# EAGLE design balloon-v02 (EAGLE 7.6.0)
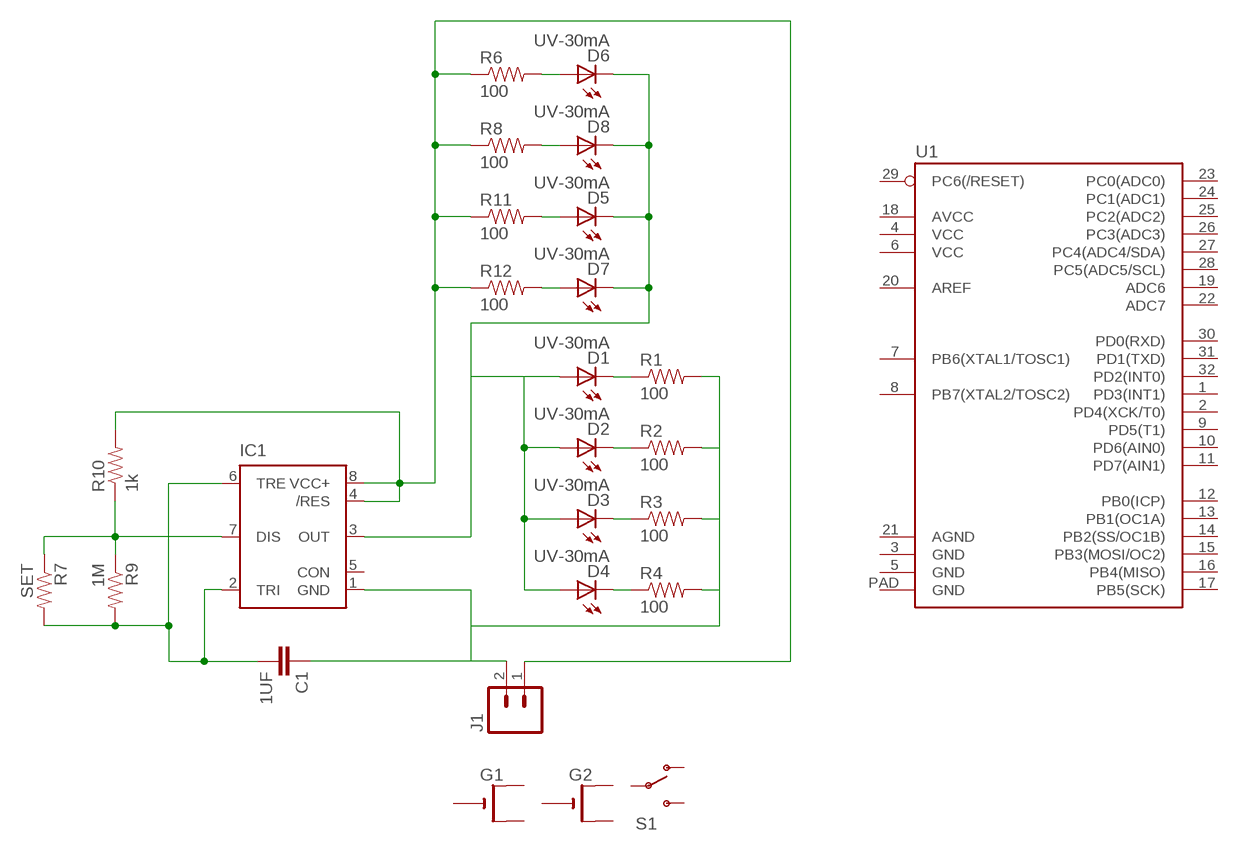
[diagram p0: schematic, sheet 1]

## Parts
C1  1UF  CAP0603-CAP  [0603-CAP]
D1  UV-30mA  LEDCHIPLED_0603  [CHIPLED_0603]
D2  UV-30mA  LEDCHIPLED_0603  [CHIPLED_0603]
D3  UV-30mA  LEDCHIPLED_0603  [CHIPLED_0603]
D4  UV-30mA  LEDCHIPLED_0603  [CHIPLED_0603]
D5  UV-30mA  LEDCHIPLED_0603  [CHIPLED_0603]
D6  UV-30mA  LEDCHIPLED_0603  [CHIPLED_0603]
D7  UV-30mA  LEDCHIPLED_0603  [CHIPLED_0603]
D8  UV-30mA  LEDCHIPLED_0603  [CHIPLED_0603]
G1  CR2032SMT  [CR2032-SMD]
G2  CR2032SMT  [CR2032-SMD]
IC1  NE555D  [SO08]
J1  M02PTH3  [1X02_LONGPADS]
R1  100  RESISTOR0603-RES  [0603-RES]
R2  100  RESISTOR0603-RES  [0603-RES]
R3  100  RESISTOR0603-RES  [0603-RES]
R4  100  RESISTOR0603-RES  [0603-RES]
R6  100  RESISTOR0603-RES  [0603-RES]
R7  SET  RESISTORKIT  [AXIAL-0.3-KIT]
R8  100  RESISTOR0603-RES  [0603-RES]
R9  1M  RESISTOR0603-RES  [0603-RES]
R10  1k  RESISTOR0603-RES  [0603-RES]
R11  100  RESISTOR0603-RES  [0603-RES]
R12  100  RESISTOR0603-RES  [0603-RES]
S1  SWITCH-SPDT-SMD-A  [SWITCH-SPST-SMD-A]
U1  ATMEGA328P_MLFMLF32  [MLF32-PAD]

## Nets
DISCHARGE: IC1.7(DIS) R7.P$1 R9.1 R10.1
GND: C1.1 IC1.1(GND) J1.2 R1.2 R2.2 R3.2 R4.2
N$1: D8.A R8.2
N$2: D5.A R11.2
N$3: D1.C R1.1
N$4: D7.A R12.2
N$5: D2.C R2.1
N$6: D6.A R6.2
N$7: D3.C R3.1
N$9: D4.C R4.1
OUT: D1.A D2.A D3.A D4.A D5.C D6.C D7.C D8.C IC1.3(OUT)
THRESHOLD: C1.2 IC1.2(TRI) IC1.6(TRE) R7.P$2 R9.2
VCC: IC1.4(/RES) IC1.8(VCC+) J1.1 R6.1 R8.1 R10.2 R11.1 R12.1
Unconnected: G1.+$1(+) G1.+$2(+1) G1.- G2.+$1(+) G2.+$2(+1) G2.- IC1.5(CON) S1.1(O) S1.2(P) S1.3(S) U1.1(PD3(INT1)) U1.2(PD4(XCK/T0)) U1.3(GND) U1.4(VCC) U1.5(GND) U1.6(VCC) U1.7(PB6(XTAL1/TOSC1)) U1.8(PB7(XTAL2/TOSC2)) U1.9(PD5(T1)) U1.10(PD6(AIN0)) U1.11(PD7(AIN1)) U1.12(PB0(ICP)) U1.13(PB1(OC1A)) U1.14(PB2(SS/OC1B)) U1.15(PB3(MOSI/OC2)) U1.16(PB4(MISO)) U1.17(PB5(SCK)) U1.18(AVCC) U1.19(ADC6) U1.20(AREF) U1.21(AGND) U1.22(ADC7) U1.23(PC0(ADC0)) U1.24(PC1(ADC1)) U1.25(PC2(ADC2)) U1.26(PC3(ADC3)) U1.27(PC4(ADC4/SDA)) U1.28(PC5(ADC5/SCL)) U1.29(PC6(/RESET)) U1.30(PD0(RXD)) U1.31(PD1(TXD)) U1.32(PD2(INT0)) U1.PAD(GND)

## Library data of the parts
C1 = SparkFun-Capacitors:CAP: Capacitor Standard 0603 ceramic capacitor, and 0.1" leaded capacitor.; DIGIKEY_PART_ID: 1276-1946-1-ND
D1-D8 = led:LED: LED OSRAM: - CHIPLED LG R971, LG N971, LY N971, LG Q971, LY Q971, LO R971, LY R971 LH N974, LH R974 LS Q976, LO Q976, LY Q976 LO Q996 - Hyper CHIPLED LW Q18S LB Q993, LB Q99A, LB R99A - SideLED LS A670, LO A670, LY A670, LG A670, LP A670 LB A673, LV A673, LT A673, LW A673 LH A674 LY A675 LS A676, LA A676, LO A676, LY A676, LW A676 LS A679, LY A679, LG A679 - Hyper Micro SIDELED® LS Y876, LA Y876, LO Y876, LY Y876 LT Y87S - SmartLED LW L88C, LW L88S LB L89C, LB L89S, LG L890 LS L89K, LO L89K, LY L89K LS L896, LA L896, LO L896, LY L896 - TOPLED LS T670, LO T670, LY T670, LG T670, LP T670 LSG T670, LSP T670, LSY T670, LOP T670, LYG T670 LG T671, LOG T671, LSG T671 LB T673, LV T673, LT T673, LW T673 LH T674 LS T676, LA T676, LO T676, LY T676, LB T676, LH T676, LSB T676, LW T676 LB T67C, LV T67C, LT T67C, LS T67K, LO T67K, LY T67K, LW E67C LS E67B, LA E67B, LO E67B, LY E67B, LB E67C, LV E67C, LT E67C LW T67C LS T679, LY T679, LG T679 LS T770, LO T770, LY T770, LG T770, LP T770 LB T773, LV T773, LT T773, LW T773 LH T774 LS E675, LA E675, LY E675, LS T675 LS T776, LA T776, LO T776, LY T776, LB T776 LHGB T686 LT T68C, LB T68C - Hyper Mini TOPLED® LB M676 - Mini TOPLED Santana® LG M470 LS M47K, LO M47K, LY M47K Source: http://www.osram.convergy.de LUXEON: - LUMILED® LXK2-PW12-R00, LXK2-PW12-S00, LXK2-PW14-U00, LXK2-PW14-V00 LXK2-PM12-R00, LXK2-PM12-S00, LXK2-PM14-U00 LXK2-PE12-Q00, LXK2-PE12-R00, LXK2-PE12-S00, LXK2-PE14-T00, LXK2-PE14-U00 LXK2-PB12-K00, LXK2-PB12-L00, LXK2-PB12-M00, LXK2-PB14-N00, LXK2-PB14-P00, LXK2-PB14-Q00 LXK2-PR12-L00, LXK2-PR12-M00, LXK2-PR14-Q00, LXK2-PR14-R00 LXK2-PD12-Q00, LXK2-PD12-R00, LXK2-PD12-S00 LXK2-PH12-R00, LXK2-PH12-S00 LXK2-PL12-P00, LXK2-PL12-Q00, LXK2-PL12-R00 Source: www.luxeon.com KINGBRIGHT: KA-3528ASYC Source: www.kingbright.com
G1 G2 = adafruit:CR2032; DIGIKEY_PART_ID: BK-913-ND
IC1 = SparkFun-AnalogIC:NE555: General purpose bipolar Timer; DIGIKEY_PART_ID: ICM7555CBAZ-TCT-ND
J1 = SparkFun-Connectors:M02: Standard 2-pin 0.1" header. Use with - straight break away headers ( PRT-00116) - right angle break away headers (PRT-00553) - swiss pins (PRT-00743) - machine pins (PRT-00117) - female headers (PRT-00115) Molex polarized connector foot print use with: PRT-08233 with associated crimp pins and housings. 2.54_SCREWTERM for use with PRT-10571. 3.5mm Screw Terminal footprints for PRT-08084 5mm Screw Terminal footprints for use with PRT-08432
R1-R4 R6 R8 R11 R12 = SparkFun-Resistors:RESISTOR: Resistor Basic schematic elements and footprints for 0603, 1206, and PTH resistors.; DIGIKEY_PART_ID: P100BZCT-ND
R7 R9 = SparkFun-Resistors:RESISTOR: Resistor Basic schematic elements and footprints for 0603, 1206, and PTH resistors.; DIGIKEY_PART_ID: P1MBZCT-ND
R10 = SparkFun-Resistors:RESISTOR: Resistor Basic schematic elements and footprints for 0603, 1206, and PTH resistors.; DIGIKEY_PART_ID: P1KBZCT-ND
S1 = SparkFun-Electromechanical:SWITCH-SPDT: SPDT Switch Simple slide switch, Spark Fun Electronics SKU : COM-00102 DPDT SMT slide switch, AYZ0202, SWCH-08179; DIGIKEY_PART_ID: 679-1847-1-ND; PROD_ID: SWCH-10651
U1 = SparkFun-DigitalIC:ATMEGA328P_MLF: 32-Pin Atmega328 part Commonly used on Arduino compatible boards Available in QFP and QFN packages TQFP is IC-09069 QFN is non-stock

## Board
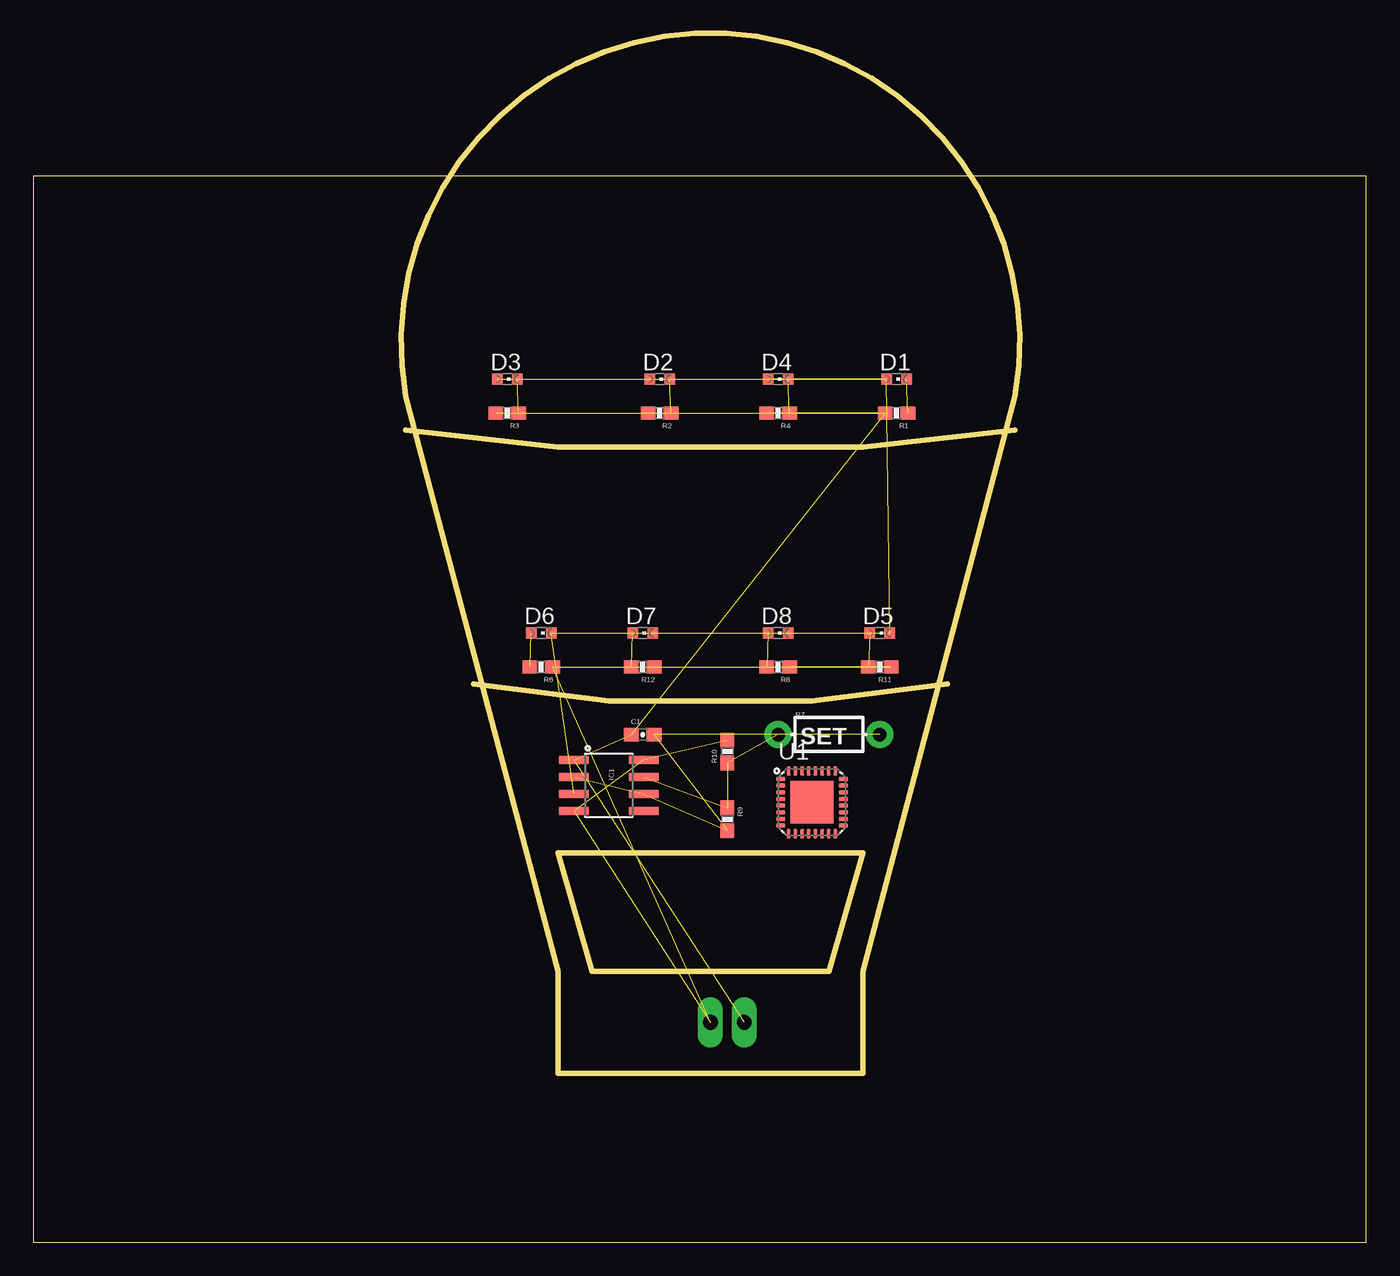
[diagram p1: board, top side]
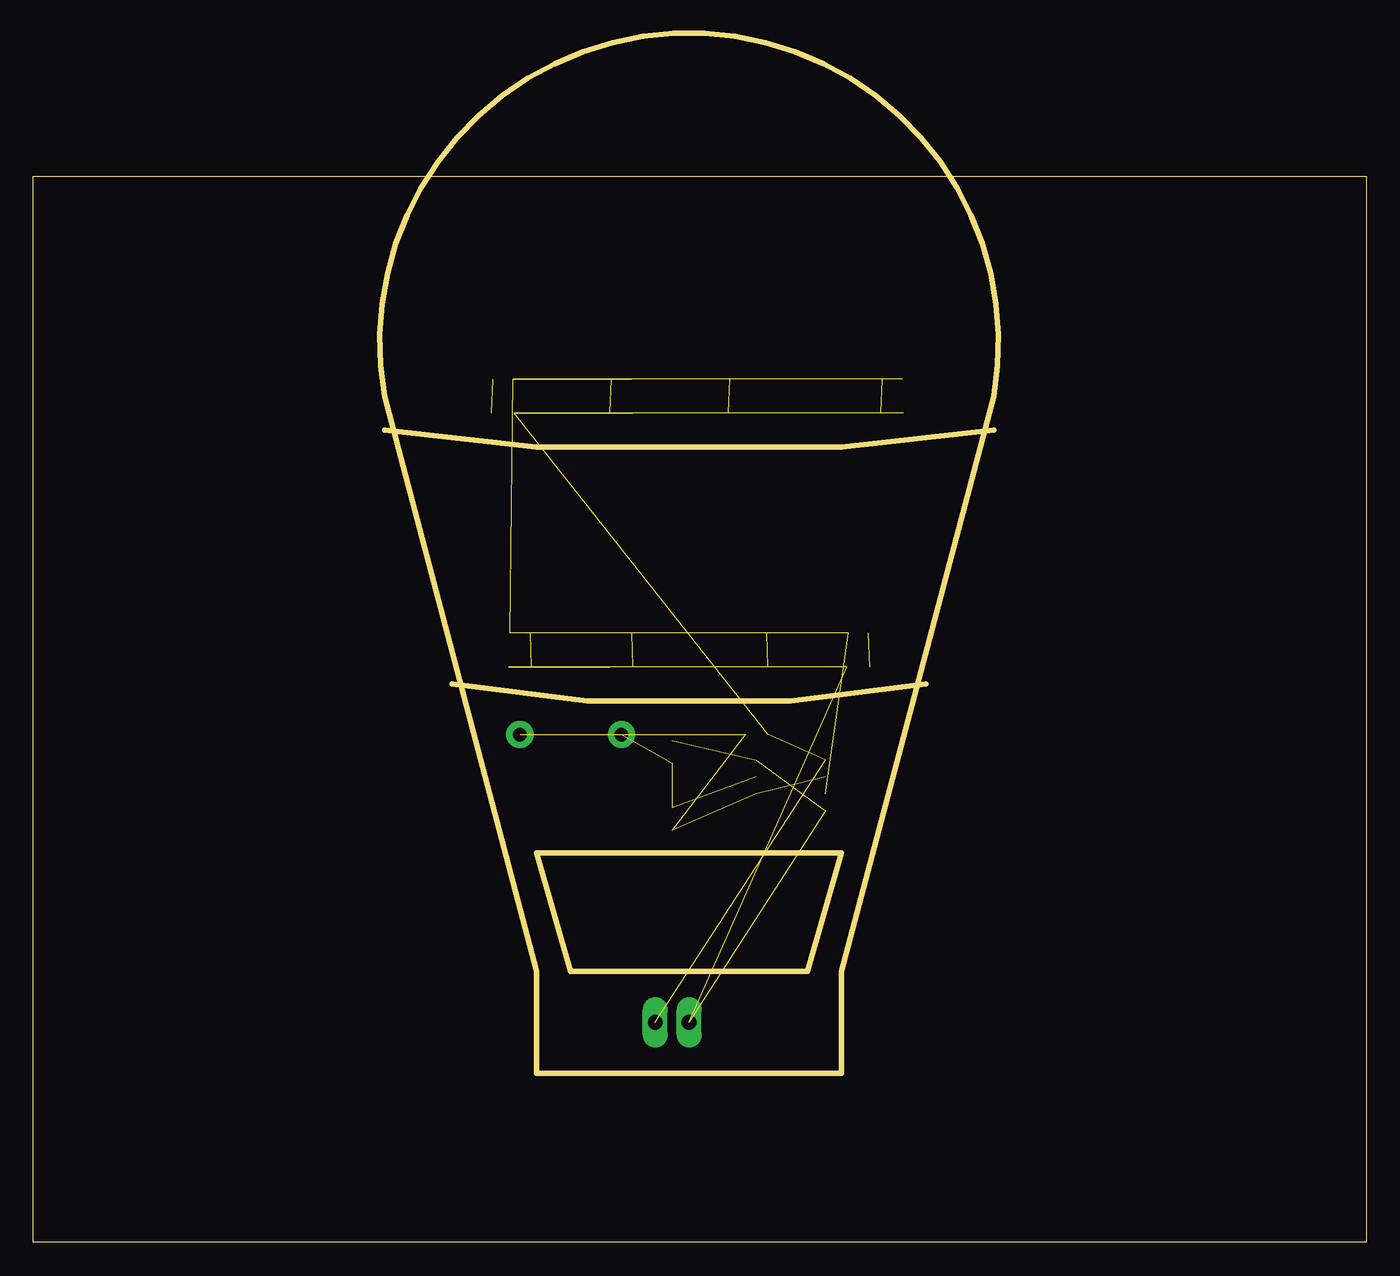
[diagram p2: board, bottom side, seen from below]

Size 100 x 90.72 mm. Coordinates in mm from the lower left corner, seen from the top.
Outline: 27.94,60.96 39.37,59.69 62.23,59.69 73.66,60.96
Outline: 33.02,41.91 43.18,40.64 58.42,40.64 68.58,41.91
Outline: 0,0 100,0 100,80 0,80 0,0
Outline: 27.94,63.5 arc-200 73.66,63.5 62.23,20.32 62.23,12.7 39.37,12.7 39.37,20.32 27.94,63.5
Outline: 39.37,29.21 41.91,20.32 59.69,20.32 62.23,29.21 39.37,29.21
Copper layers (1*16): Top 0.035mm / dielectric 1.5mm / Bottom 0.035mm
Design rules "default": minimum track width 10mil, minimum drill 24mil, track to track 8mil, track to pad 8mil, pad to pad 8mil, via to via 8mil, smd to smd 8mil, copper to edge 40mil, drill to drill 8mil, minimum pad ring 10mil, minimum via ring 8mil, stop-mask expansion 4mil, vias tented up to drill 0mil, thermal gap 10mil

### Footprints (pad centres in the part's own frame; a part is rotated, then mirrored left to right if it is on the bottom)
0603-CAP = smd 1.1 x 1: 1 -0.85,0; 2 0.85,0
CHIPLED_0603 = smd 0.8 x 0.8: A 0,-0.75; C 0,0.75
CR2032-SMD = smd 5.08 x 5.08: +$1 -12.7,0; +$2 12.7,0 | smd 4.064 x 4.064: - 0,0
SO08 = smd 0.61 x 2.21: 1 -1.905,-2.616; 2 -0.635,-2.616; 3 0.635,-2.616; 4 1.905,-2.616; 5 1.905,2.616; 6 0.635,2.616; 7 -0.635,2.616; 8 -1.905,2.616
1X02_LONGPADS = drill 1.118 pad 1.88 long: 1 0,0; 2 2.54,0
0603-RES = smd 1.1 x 1: 1 -0.85,0; 2 0.85,0
AXIAL-0.3-KIT = drill 1.016 pad 2.032: P$1 -3.81,0; P$2 3.81,0
SWITCH-SPST-SMD-A = smd 0.7 x 1.5: 1 -2.25,-1.75; 2 -0.75,-1.75; 3 2.25,-1.75 | smd 1 x 0.6: GND1 -3.65,1; GND3 3.65,1 | smd 1 x 0.8: GND2 -3.65,-1.1; GND4 3.65,-1.1 | hole 0.9: -1.5,0; 1.5,0
MLF32-PAD = smd 0.7 x 0.3: 1 -2.35,1.75; 2 -2.35,1.25; 3 -2.35,0.75; 4 -2.35,0.25; 5 -2.35,-0.25; 6 -2.35,-0.75; 7 -2.35,-1.25; 8 -2.35,-1.75; 17 2.35,-1.75; 18 2.35,-1.25; 19 2.35,-0.75; 20 2.35,-0.25; 21 2.35,0.25; 22 2.35,0.75; 23 2.35,1.25; 24 2.35,1.75 | smd 0.3 x 0.7: 9 -1.75,-2.35; 10 -1.25,-2.35; 11 -0.75,-2.35; 12 -0.25,-2.35; 13 0.25,-2.35; 14 0.75,-2.35; 15 1.25,-2.35; 16 1.75,-2.35; 25 1.75,2.35; 26 1.25,2.35; 27 0.75,2.35; 28 0.25,2.35; 29 -0.25,2.35; 30 -0.75,2.35; 31 -1.25,2.35; 32 -1.75,2.35 | smd 3.2 x 3.2: PAD 0,0

### Placement (x,y rotation side)
C1  45.72,38.1 0 top
D1  64.77,64.77 270 top
D2  46.99,64.77 270 top
D3  35.56,64.77 270 top
D4  55.88,64.77 270 top
D5  63.5,45.72 270 top
D6  38.1,45.72 270 top
D7  45.72,45.72 270 top
D8  55.88,45.72 270 top
G1  -29.21,11.43 0 top  (outside the outline)
G2  -29.21,34.29 0 top  (outside the outline)
IC1  43.18,34.29 270 top
J1  50.8,16.51 0 top
R1  64.77,62.23 180 top
R2  46.99,62.23 180 top
R3  35.56,62.23 180 top
R4  55.88,62.23 180 top
R6  38.1,43.18 180 top
R7  59.69,38.1 0 top
R8  55.88,43.18 180 top
R9  52.07,31.75 270 top
R10  52.07,36.83 90 top
R11  63.5,43.18 180 top
R12  45.72,43.18 180 top
S1  -31.75,58.42 0 top  (outside the outline)
U1  58.42,33.02 0 top

### Tracks (layer width: path | path; a pad name or v marks a point on that pad's centre or on a via)
DISCHARGE  (3 unrouted)
GND  (6 unrouted)
N$1  (1 unrouted)
N$2  (1 unrouted)
N$3  (1 unrouted)
N$4  (1 unrouted)
N$5  (1 unrouted)
N$6  (1 unrouted)
N$7  (1 unrouted)
N$8
  Bottom 0.406: 39.37,29.21 62.23,29.21 59.69,20.32 41.91,20.32 39.37,29.21
N$9  (1 unrouted)
N$10
  Bottom 0.406: 39.37,20.32 39.37,12.7 62.23,12.7 62.23,20.32
OUT  (8 unrouted)
THRESHOLD  (4 unrouted)
VCC  (7 unrouted)
(copper drawn outside any net)
  shapes: Bottom circle x1